# Altium project KOSVT-1.PrjPcb
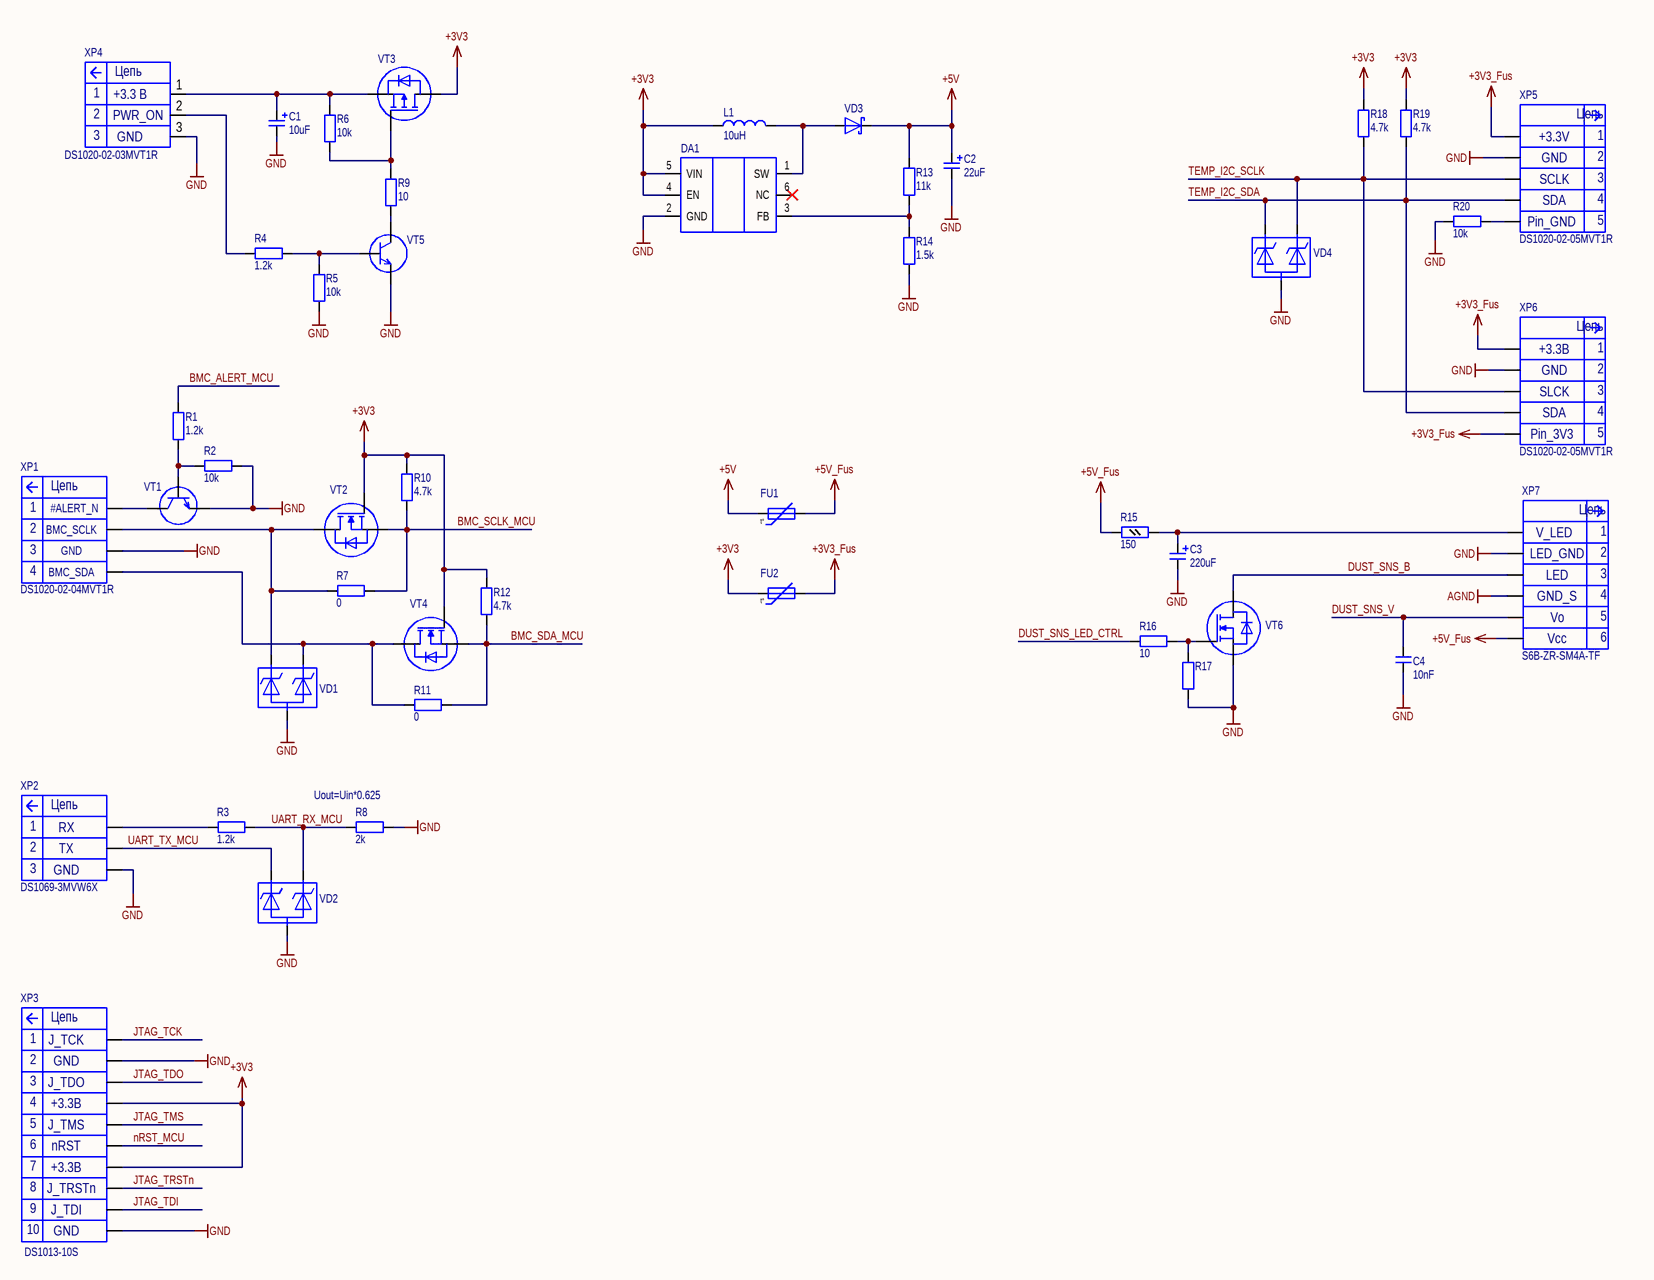
[diagram p0: MAIN.SchDoc]
Формат_PCB: А3; Обозначение_Код: XXXX.468332.001Э3; Обозначение_PCB: XXXX.468332.001Э3; Обозначение: XXXX.468332.001; Наименование_PCB: КОСВТ-01; Наименование1: КОСВТ-01; Наименование: КОСВТ-01; Код_документа_SCH: Э3; Вид_документа_SCH: Схема электрическая принципиальная; Вид_документа: Э3; ProjectName: KOSVT-01; Patch_version: 0; Minor_version: 1; Major_version: 2
2 sheets, 90 parts. Net scope: global (net labels, ports and power ports of the same name join across sheets).
Board file: KOSVT-1.PcbDoc
Sheets:
  MAIN.SchDoc
  MCU.SchDoc

## Sheet MAIN.SchDoc
size 420 x 297 mm; Address1: Address1; Address2: Address2; Address3: Address3; Address4: Address4; SheetNumber: 1; SheetTotal: 2; Разраб.: Шкляев; Обозначение документа: ВРГД.468332.001 Э3; Пров.: Абрамов; Н.контр.: Ермакова; Утв.: Солдатченков; Наименование организации: АО "Вектор развития"; Перв. применение: ВРГД.468332.001; Наименование изделия 1: Плата; Наименование изделия 2: Схема электрическая; Наименование изделия 3: принципиальная; Нач. отд.: Нач. отд.; Фамилия нач. отд.: Кононенко; Наименование изделия 4: КОСВТ-1

### Parts
C1  10uF  [CAP ALSMD ELEC 4.3MM H5.4MM]
C2  22uF  [CAP ALSMD ELEC 4.3MM H5.4MM]
C3  220uF  [CAP ALSMD ELEC 6.6MM H7.7MM]
C4  10nF  [CAP 0603_1608]
DA1  MT3608 AEROSEMI  [TI SOT-23-6 DBV]  (value not drawn)
FU1  BSMD0603-010-15V BHFUSE  [FUSE 0603_1608 0.8MM]  (value not drawn)
FU2  BSMD0603-010-15V BHFUSE  [FUSE 0603_1608 0.8MM]  (value not drawn)
L1  10uH  [MURATA LQH32CN]
R1  1.2k  [RES 0603_1608]
R2  10k  [RES 0603_1608]
R3  1.2k  [RES 0603_1608]
R4  1.2k  [RES 0603_1608]
R5  10k  [RES 0603_1608]
R6  10k  [RES 0603_1608]
R7  0  [RES 0603_1608]
R8  2k  [RES 0603_1608]
R9  10  [RES 0603_1608]
R10  4.7k  [RES 0603_1608]
R11  0  [RES 0603_1608]
R12  4.7k  [RES 0603_1608]
R13  11k  [RES 0603_1608]
R14  1.5k  [RES 0603_1608]
R15  150  [RES 0805_2012]
R16  10  [RES 0603_1608]
R17  (no value)  [RES 0603_1608]
R18  4.7k  [RES 0603_1608]
R19  4.7k  [RES 0603_1608]
R20  10k  [RES 0603_1608]
VD1  PESD5V0U1UT  [SOT-23-3 N]  (value not drawn)
VD2  PESD5V0U1UT  [SOT-23-3 N]  (value not drawn)
VD3  1N5817WS Hottech  [MCC SOD-323]  (value not drawn)
VD4  PESD5V0U1UT  [SOT-23-3 N]  (value not drawn)
VT1  КТ229Б9  [SOT-23-3 N]  (value not drawn)
VT2  КП526А9  [SOT-23-3 N]  (value not drawn)
VT3  AO3401 Hottech  [SOT-23-3 N]  (value not drawn)
VT4  КП526А9  [SOT-23-3 N]  (value not drawn)
VT5  КТ229Б9  [SOT-23-3 N]  (value not drawn)
VT6  КП526А9  [SOT-23-3 N]  (value not drawn)
XP1  DS1020-02-04MVT1R  Net_4: BMC_SDA  Net_3: GND  Net_2: BMC_SCLK  Net_1: #ALERT_N  [DS1020-02-04MVT1R]
XP2  DS1069-3MVW6X  Net_3: GND  Net_1: RX  Net_2: TX  [CONNFLY_DS1069-3M]
XP3  DS1013-10S  Net_10: GND  Net_9: J_TDI  Net_8: J_TRSTn  Net_7: +3.3В  Net_6: nRST  Net_5: J_TMS  Net_3: J_TDO  Net_1: J_TCK  [DS1013-10S]
XP4  DS1020-02-03MVT1R  Net_3: GND  Net_1: +3.3 В  Net_2: PWR_ON  [DS1020-02-03MVT1R]
XP5  DS1020-02-05MVT1R  Net_5: Pin_GND  Net_4: SDA  Net_3: SCLK  Net_2: GND  Net_1: +3.3V  [DS1020-02-05MVT1R]
XP6  DS1020-02-05MVT1R  Net_5: Pin_3V3  Net_4: SDA  Net_3: SLCK  Net_2: GND  Net_1: +3.3В  [DS1020-02-05MVT1R]
XP7  S6B-ZR-SM4A-TF  Net_6: Vcc  Net_5: Vo  Net_4: GND_S  Net_3: LED  Net_2: LED_GND  Net_1: V_LED  [JST S6B-ZR-SM4A-TF]

### Nets
+3V3: DA1.4(EN) DA1.5(VIN) FU2.1 L1.1(P) R10.2 R12.2 R18.2 R19.2 VT2.1(G) VT3.3(D) VT4.1(G) XP3.4 XP3.7
+3V3_Fus: FU2.2 XP5.1 XP6.1 XP6.5
+5V: C2.1(P) FU1.1 R13.2 VD3.2(C)
+5V_Fus: FU1.2 R15.1 XP7.6
AGND: XP7.4
GND: C1.2(N) C2.2(N) C3.2(N) C4.1 DA1.2(GND) R2.1 R5.1 R8.2 R14.1 R17.1 R20.2 VD1.3(A) VD2.3(A) VD4.3(A) VT1.2(E) VT5.2(E) VT6.2(S) XP1.3 XP2.3 XP3.2 XP3.10 XP4.3 XP5.2 XP6.2 XP7.2
BMC_ALERT_MCU: R1.2
BMC_SCLK_MCU: R7.1 R10.1 VT2.2(S)
BMC_SDA_MCU: R11.1 R12.1 VT4.2(S)
DUST_SNS_B: VT6.3(D) XP7.3
DUST_SNS_LED_CTRL: R16.1
DUST_SNS_V: C4.2 XP7.5
JTAG_TCK: XP3.1
JTAG_TDI: XP3.9
JTAG_TDO: XP3.3
JTAG_TMS: XP3.5
JTAG_TRSTn: XP3.8
nRST_MCU: XP3.6
TEMP_I2C_SCLK: R18.1 VD4.2(C2) XP5.3 XP6.3
TEMP_I2C_SDA: R19.1 VD4.1(C1) XP5.4 XP6.4
UART_RX_MCU: R3.2 R8.1 VD2.2(C2)
UART_TX_MCU: VD2.1(C1) XP2.2
NetC1_1: C1.1(P) R6.2 VT3.2(S) XP4.1
NetC3_1: C3.1(P) R15.2 XP7.1
NetDA1_1: DA1.1(SW) L1.2(N) VD3.1(A)
NetDA1_3: DA1.3(FB) R13.1 R14.2
NetR1_1: R1.1 R2.2 VT1.1(B)
NetR3_1: R3.1 XP2.1
NetR4_1: R4.1 XP4.2
NetR4_2: R4.2 R5.2 VT5.1(B)
NetR6_1: R6.1 R9.1 VT3.1(G)
NetR7_2: R7.2 VD1.1(C1) VT2.3(D) XP1.2
NetR9_2: R9.2 VT5.3(C)
NetR11_2: R11.2 VD1.2(C2) VT4.3(D) XP1.4
NetR16_2: R16.2 R17.2 VT6.1(G)
NetR20_1: R20.1 XP5.5
NetVT1_3: VT1.3(C) XP1.1

Not connected (* = marked no-connect by the designer): DA1 6(NC)*

### Notes on the sheet
- (near R8) Uout=Uin*0.625
- Перв. примен.
- Справ. №
- Подп. и дата
- Инв. № дубл.
- Взам. инв. №
- Разраб.
- Изм.
- Лист
- № докум.
- Подп.
- Дата
- Лит.
- Масса
- Масштаб
- Пров.
- Листов
- Инв. № подл.
- Утв.
- Н.контр.
- Копировал
- Формат А3
- (in symbol BSMD0603-010-15V BHFUSE) t°
- (in symbol DS1013-10S) Цепь
- (in symbol DS1020-02-03MVT1R) Цепь
- (in symbol DS1020-02-04MVT1R) Цепь
- (in symbol DS1020-02-05MVT1R) Цепь
- (in symbol DS1069-3MVW6X) Цепь
- (in symbol S6B-ZR-SM4A-TF) Цепь

### Library data of the parts
C1 = К50-97 – 25В – 10мкФ (±20) % – ЕВАЯ.673541.054ТУ: Конденсатор К50-97 – 25В – 10мкФ (±20) % – ЕВАЯ.673541.054ТУ; Manufacturer: АО Элеконд; Group: Конденсаторы полярные; Type: Конденсатор электролитический; Tolerance: ± 20%; Dielectric type: Electrolytic; Voltage: 25V; Manufacturer Part Number: К50-97 – 25В – 10мкФ (±20) % – ЕВАЯ.673541.054ТУ; Name: К50-97 – 25В – 10мкФ (±20) % – ЕВАЯ.673541.054ТУ; Value: 10uF; Country: Россия; Package: SMD D4x5.4; HelpURL: https://elecond.ru/pdf/k50-97.pdf
C2 = К50-97 – 16В – 22мкФ (±20) % – ЕВАЯ.673541.054ТУ: Конденсатор К50-97 – 16В – 22мкФ (±20) % – ЕВАЯ.673541.054ТУ; Manufacturer: АО Элеконд; Group: Конденсаторы полярные; Type: Конденсатор электролитический; Tolerance: ± 20%; Dielectric type: Electrolytic; Voltage: 16V; Manufacturer Part Number: К50-97 – 16В – 22мкФ (±20) % – ЕВАЯ.673541.054ТУ; Name: К50-97 – 16В – 22мкФ (±20) % – ЕВАЯ.673541.054ТУ; Value: 22uF; Country: Россия; Package: SMD D4x5.4; HelpURL: https://elecond.ru/pdf/k50-97.pdf
C3 = К50-97 – 16В – 220мкФ (±20) % – ЕВАЯ.673541.054ТУ: Конденсатор К50-97 – 16В – 220мкФ (±20) % – ЕВАЯ.673541.054ТУ; Manufacturer: АО Элеконд; Group: Конденсаторы полярные; Type: Конденсатор электролитический; Tolerance: ± 20%; Dielectric type: Electrolytic; Voltage: 16V; Manufacturer Part Number: К50-97 – 16В – 220мкФ (±20) % – ЕВАЯ.673541.054ТУ; Name: К50-97 – 16В – 220мкФ (±20) % – ЕВАЯ.673541.054ТУ; Value: 220uF; Country: Россия; Package: SMD D6.3x7.7; HelpURL: https://elecond.ru/pdf/k50-97.pdf
C4 = GRM188R71E103K: Конденсатор 0603-X7R-25В-10мкФ ± 10%; Manufacturer: Murata Electronics; Group: Конденсаторы; Type: Конденсатор керамический; Dielectric type: X7R; Voltage: 25V; Manufacturer Part Number: GRM188R71E103K; Name: GRM188R71E103K; Value: 10nF; Tolerance: ± 10%; Country: Япония; Package: SMD0603
DA1 = MT3608 AEROSEMI: Микросхема MT3608; Group: Микросхемы; Input Voltage: 2V to 24V; Output Voltage: Up to 28V; Max Temperature: 150°С; Min Temperature: -40°С; Manufacturer Part Number: MT3608 AEROSEMI; Type: Импульсный повышающий преобразователь; Name: MT3608; Country: Китай; Manufacturer: AEROSEMI; Package: SOT23-6
FU1 FU2 = BSMD0603-010-15V BHFUSE: Предохранитель самовосстанавливающийся BSMD0603-010-15V; Group: Предохранители; I hold: 0.1A; I trip: 0.3A; V: 15V; Manufacturer Part Number: BSMD0603-010-15V BHFUSE; Type: Предохранитель самовосстанавливающийся; Name: BSMD0603-010-15V; Country: Китай; Manufacturer: BHFUSE; Package: SMD0603; HelpURL: https://static.chipdip.ru/lib/966/DOC042966016.pdf
L1 = LQH32CN100K33L: Индуктивность 1210-0,45A-10мкГ ± 10%; Manufacturer: Murata Electronics; Group: Индуктивности; Current: 450mA; Rdc: 0.3Ohm; SRfreq: 26MHz; Manufacturer Part Number: LQH32CN100K33L; Type: Индуктивности; Name: LQH32CN100K33L; Value: 10uH; Tolerance: ± 10%; Country: Япония; Package: SMD1206
R1 R3 R4 = Р1-12 - 0,1 - 1,2кОм ±1%: Резистор Р1-12 - 0,1 - 1,2кОм ±1%; Manufacturer: АО «Ресурс»; Group: Резисторы; Power: 0.1W; Voltage: 50V; Manufacturer Part Number: Р1-12 - 0,1 - 1,2кОм ±1%; Type: Резистор; Name: Р1-12 - 0,1 - 1,2кОм ±1%; Value: 1.2k; Tolerance: ± 1%; Country: Россия; Package: SMD0603; HelpURL: https://aoresurs.com/upload/iblock/4b6/hnw668dxbiwjyxv0ejq9urcu5m58703r/Datasheet-R1_12-SHKAB.434110.024TU.pdf
R2 R5 R6 R20 = Р1-12 - 0,1 - 10кОм ±1%: Резистор Р1-12 - 0,1 - 10кОм ±1%; Manufacturer: АО «Ресурс»; Group: Резисторы; Power: 0.1W; Voltage: 50V; Manufacturer Part Number: Р1-12 - 0,1 - 10кОм ±1%; Type: Резистор; Name: Р1-12 - 0,1 - 10кОм ±1%; Value: 10k; Tolerance: ± 1%; Country: Россия; Package: SMD0603; HelpURL: https://aoresurs.com/upload/iblock/4b6/hnw668dxbiwjyxv0ejq9urcu5m58703r/Datasheet-R1_12-SHKAB.434110.024TU.pdf
R7 R11 = Р1-12 - 0603 - 0,05: Перемычка Р1-12 - 0603 - 0,05; Manufacturer: АО «Ресурс»; Group: Резисторы; Power: 3A; Manufacturer Part Number: Р1-12 - 0603 - 0,05; Type: Перемычка; Name: Р1-12 - 0603 - 0,05; Value: 0; Country: Россия; Package: SMD0603; HelpURL: https://aoresurs.com/upload/iblock/b10/xo9xl0w0128k43psd6nz5q3kfcc2cprs/peremychka-R1_12-SHKAB.434110.025TU.pdf
R8 = Р1-12 - 0,1 - 2кОм ±1%: Резистор Р1-12 - 0,1 - 2кОм ±1%; Manufacturer: АО «Ресурс»; Group: Резисторы; Power: 0.1W; Voltage: 50V; Manufacturer Part Number: Р1-12 - 0,1 - 2кОм ±1%; Type: Резистор; Name: Р1-12 - 0,1 - 2кОм ±1%; Value: 2k; Tolerance: ± 1%; Country: Россия; Package: SMD0603; HelpURL: https://aoresurs.com/upload/iblock/4b6/hnw668dxbiwjyxv0ejq9urcu5m58703r/Datasheet-R1_12-SHKAB.434110.024TU.pdf
R9 R16 = Р1-12 - 0,1 - 10Ом ±1%: Резистор Р1-12 - 0,1 - 10Ом ±1%; Manufacturer: АО «Ресурс»; Group: Резисторы; Power: 0.1W; Voltage: 50V; Manufacturer Part Number: Р1-12 - 0,1 - 10Ом ±1%; Type: Резистор; Name: Р1-12 - 0,1 - 10Ом ±1%; Value: 10; Tolerance: ± 1%; Country: Россия; Package: SMD0603; HelpURL: https://aoresurs.com/upload/iblock/4b6/hnw668dxbiwjyxv0ejq9urcu5m58703r/Datasheet-R1_12-SHKAB.434110.024TU.pdf
R10 R12 R18 R19 = Р1-12 - 0,1 - 4,7кОм ±1%: Резистор Р1-12 - 0,1 - 4,7кОм ±1%; Manufacturer: АО «Ресурс»; Group: Резисторы; Power: 0.1W; Voltage: 50V; Manufacturer Part Number: Р1-12 - 0,1 - 4,7кОм ±1%; Type: Резистор; Name: Р1-12 - 0,1 - 4,7кОм ±1%; Value: 4.7k; Tolerance: ± 1%; Country: Россия; Package: SMD0603; HelpURL: https://aoresurs.com/upload/iblock/4b6/hnw668dxbiwjyxv0ejq9urcu5m58703r/Datasheet-R1_12-SHKAB.434110.024TU.pdf
R13 = Р1-12 - 0,1 - 11кОм ±1%: Резистор Р1-12 - 0,1 - 11кОм ±1%; Manufacturer: АО «Ресурс»; Group: Резисторы; Power: 0.1W; Voltage: 50V; Manufacturer Part Number: Р1-12 - 0,1 - 11кОм ±1%; Type: Резистор; Name: Р1-12 - 0,1 - 11кОм ±1%; Value: 11k; Tolerance: ± 1%; Country: Россия; Package: SMD0603; HelpURL: https://aoresurs.com/upload/iblock/4b6/hnw668dxbiwjyxv0ejq9urcu5m58703r/Datasheet-R1_12-SHKAB.434110.024TU.pdf
R14 = Р1-12 - 0,1 - 1,5кОм ±1%: Резистор Р1-12 - 0,1 - 1,5кОм ±1%; Manufacturer: АО «Ресурс»; Group: Резисторы; Power: 0.1W; Voltage: 50V; Manufacturer Part Number: Р1-12 - 0,1 - 1,5кОм ±1%; Type: Резистор; Name: Р1-12 - 0,1 - 1,5кОм ±1%; Value: 1.5k; Tolerance: ± 1%; Country: Россия; Package: SMD0603; HelpURL: https://aoresurs.com/upload/iblock/4b6/hnw668dxbiwjyxv0ejq9urcu5m58703r/Datasheet-R1_12-SHKAB.434110.024TU.pdf
R15 = Р1-12 - 0,125 - 150Ом ±1%: Резистор Р1-12 - 0,125 - 150Ом ±1%; Manufacturer: АО «Ресурс»; Group: Резисторы; Power: 0.125W; Voltage: 150V; Manufacturer Part Number: Р1-12 - 0,125 - 150Ом ±1%; Type: Резистор; Name: Р1-12 - 0,125 - 150Ом ±1%; Value: 150; Tolerance: ± 1%; Country: Россия; Package: SMD0805; HelpURL: https://aoresurs.com/upload/iblock/4b6/hnw668dxbiwjyxv0ejq9urcu5m58703r/Datasheet-R1_12-SHKAB.434110.024TU.pdf
R17 = Р1-12 - 0,1 - 10кОм ±1%: Резистор Р1-12 - 0,1 - 10кОм ±1%; Manufacturer: АО «Ресурс»; Group: Резисторы; Value: 10k; Power: 0.1W; Voltage: 50V; Manufacturer Part Number: Р1-12 - 0,1 - 10кОм ±1%; Type: Резистор; Name: Р1-12 - 0,1 - 10кОм ±1%; Tolerance: ± 1%; Country: Россия; Package: SMD0603; HelpURL: https://aoresurs.com/upload/iblock/4b6/hnw668dxbiwjyxv0ejq9urcu5m58703r/Datasheet-R1_12-SHKAB.434110.024TU.pdf
VD1 VD2 VD4 = PESD5V0U1UT: Диод ESD PESD5V0U1UT; Manufacturer: UTD Semiconductor; Group: Диоды; Type: Сборка ESD диодов; Vrwm: 5V; Manufacturer Part Number: PESD5V0U1UT; Package: SOT23-132; Name: PESD5V0U1UT; Country: Китай
VD3 = 1N5817WS Hottech: Диод Шоттки 1N5817WS; Group: Диоды; Max Vr: 20V; Max If: 1A; Manufacturer Part Number: 1N5817WS Hottech; Type: Диод Шоттки; Name: 1N5817WS; Country: Китай; Manufacturer: Hottech; Package: SOD-323
VT1 VT5 = КТ229Б9 АДКБ.432140.555 ТУ: Транзистор КТ229Б9 АДКБ.432140.555 ТУ; Manufacturer: Кремний Эл; Group: Транзисторы; Type: Транзистор биполярный; Struct: NPN; Vds/Vce: 45V; Id/Ic: 500mA; h21: 100-250; Manufacturer Part Number: КТ229Б9 АДКБ.432140.555 ТУ; Name: КТ229Б9; Country: Россия; Package: SOT-23-132; HelpURL: https://group-kremny.ru/upload/iblock/c8e/c8e3c704764e7e34f4ed87f6430e15b8.pdf
VT2 VT4 VT6 = КП526А9 АДКБ.432140.549 ТУ: Транзистор КП546А9 АДКБ.432140.549; Manufacturer: Кремний Эл; Group: Транзисторы; Type: Транзистор полевой; Struct: N-MOSFET; Vds/Vce: 30V; Id/Ic: 2; Vth: 1.45; Manufacturer Part Number: КП526А9 АДКБ.432140.549 ТУ; Name: КП526А9; Country: Россия; Package: SOT-23-132
VT3 = AO3401 Hottech: Транзистор  AO3401 Hottech; Group: Транзисторы; Type: Транзистор полевой; Struct: P-MOSFET; Vds/Vce: -30V; Id/Ic: -4A; Vth: -1.3V; Manufacturer Part Number: AO3401 Hottech; Name: AO3401; Country: Китай; Manufacturer: Hottech; Package: SOT-23-132; HelpURL: https://cdn.promelec.ru/upload/items/2023/12/08/AO3401%20SOT-23.pdf
XP1 = DS1020-02-04MVT1R: Соединитель DS1020-02-04MVT1R; Manufacturer: Connfly; Group: Соединители; Pins number: 4; Rows: 1; Nominal Voltage: 250V; Max Temperature: 105°С; Min Temperature: -40°С; Manufacturer Part Number: DS1020-02-04MVT1R; Type: Вилка угловая; Name: DS1020-02-04MVT1R; Country: Китай
XP2 = DS1069-3MVW6X: Соединитель DS1069-3MVW6X; Manufacturer: Connfly; Group: Соединители; Pins number: 3; Rows: 1; Nominal current: 3A; Nominal Voltage: 250V; Max Temperature: 85°С; Min Temperature: -25°С; Manufacturer Part Number: DS1069-3MVW6X; Type: Вилка прямая; Name: DS1069-3MVW6X; Country: Китай
XP3 = DS1013-10S: Соединитель DS1013-10S; Manufacturer: Connfly; Group: Соединители; Pins number: 10; Rows: 2; Nominal current: 1A; Nominal Voltage: 500V; Max Temperature: 105°С; Min Temperature: -40°С; Manufacturer Part Number: DS1013-10S; Type: Вилка прямая; Net_4: +3.3В; Net_2: GND; Name: DS1013-10S; Country: Китай
XP4 = DS1020-02-03MVT1R: Соединитель DS1020-02-03MVT1R; Manufacturer: Connfly; Group: Соединители; Pins number: 3; Rows: 1; Nominal Voltage: 250V; Max Temperature: 105°С; Min Temperature: -40°С; Manufacturer Part Number: DS1020-02-03MVT1R; Type: Вилка угловая; Name: DS1020-02-03MVT1R; Country: Китай
XP5 XP6 = DS1020-02-05MVT1R: Соединитель DS1020-02-05MVT1R; Manufacturer: Connfly; Group: Соединители; Pins number: 5; Rows: 1; Nominal Voltage: 250V; Max Temperature: 105°С; Min Temperature: -40°С; Manufacturer Part Number: DS1020-02-05MVT1R; Type: Вилка угловая; Name: DS1020-02-05MVT1R; Country: Китай
XP7 = S6B-ZR-SM4A-TF: Соединитель S6B-ZR-SM4A-TF; Manufacturer: JST; Group: Соединители; Pins number: 6; Rows: 1; Nominal current: 1A; Nominal Voltage: 50V; Max Temperature: 85°С; Min Temperature: -25°С; Manufacturer Part Number: S6B-ZR-SM4A-TF; Type: Вилка угловая; Name: S6B-ZR-SM4A-TF; Country: Япония

## Sheet MCU.SchDoc
size 420 x 297 mm; Address1: Address1; Address2: Address2; Address3: Address3; Address4: Address4; SheetNumber: 2; SheetTotal: 2; Scale: 1:1; Обозначение документа: ВРГД.468332.001 Э3
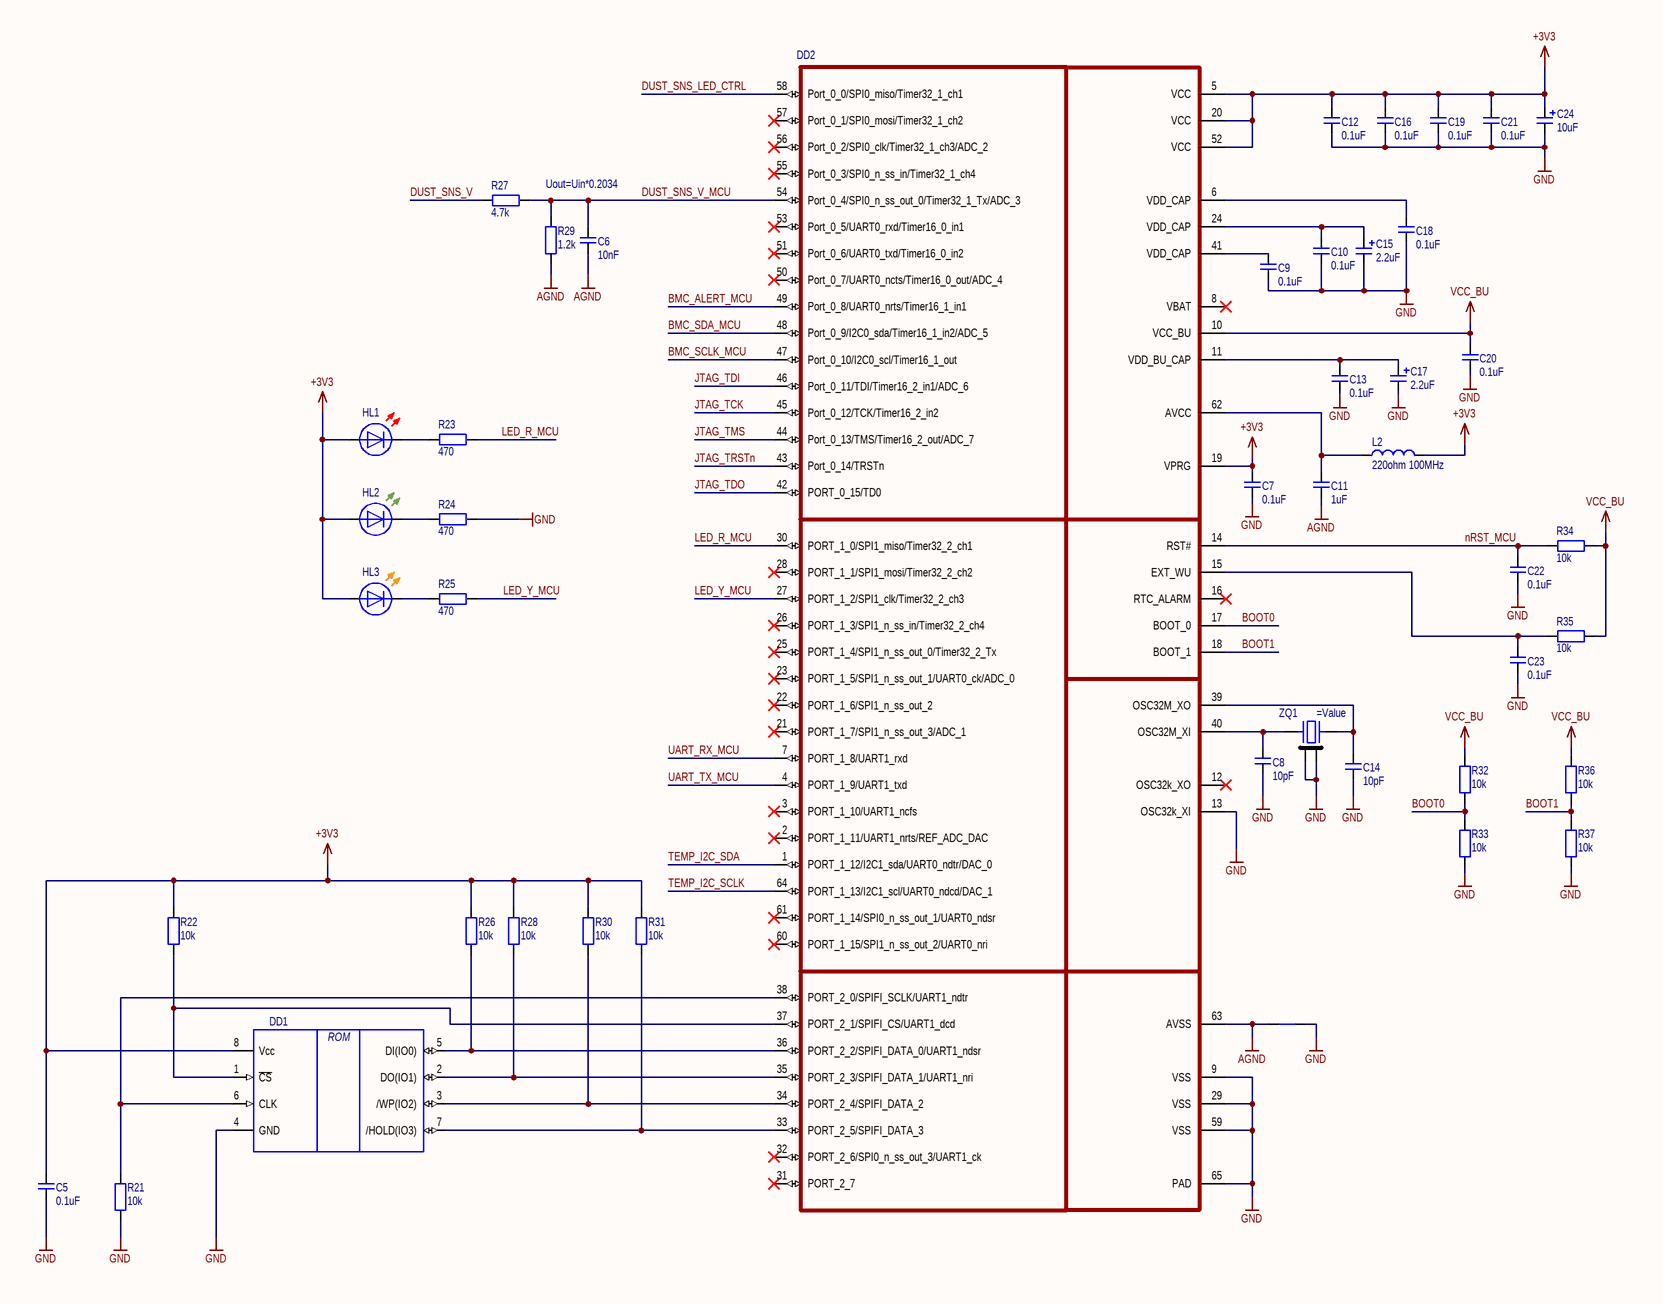
[diagram p1: MCU.SchDoc]

### Parts
C5  0.1uF  [CAP 0603_1608]
C6  10nF  [CAP 0603_1608]
C7  0.1uF  [CAP 0603_1608]
C8  10pF  [CAP 0603_1608]
C9  0.1uF  [CAP 0603_1608]
C10  0.1uF  [CAP 0603_1608]
C11  1uF  [CAP 0805_2012]
C12  0.1uF  [CAP 0603_1608]
C13  0.1uF  [CAP 0603_1608]
C14  10pF  [CAP 0603_1608]
C15  2.2uF  [CAP ALSMD ELEC 4.3MM H5.4MM]
C16  0.1uF  [CAP 0603_1608]
C17  2.2uF  [CAP ALSMD ELEC 4.3MM H5.4MM]
C18  0.1uF  [CAP 0603_1608]
C19  0.1uF  [CAP 0603_1608]
C20  0.1uF  [CAP 0603_1608]
C21  0.1uF  [CAP 0603_1608]
C22  0.1uF  [CAP 0603_1608]
C23  0.1uF  [CAP 0603_1608]
C24  10uF  [CAP ALSMD ELEC 4.3MM H5.4MM]
DD1  W25Q16JVSNIQ  [WINBOND SOIC-8]  (value not drawn)
DD2  К1948ВК018 АДКБ.431290.418ТУ  [QFN40P800X800X76_HS-65M]  (value not drawn)
HL1  KP-1608SURC  [LED 0603_1608 RED]  (value not drawn)
HL2  KPH-1608MGC  [LED 0603_1608 GREEN]  (value not drawn)
HL3  KPH-1608SYC  [LED 0603_1608 YELLOW]  (value not drawn)
J1  (no value)  [NET_TIE_1MM]  (net tie, no BOM)
L2  220ohm 100MHz  [FER 0805_2012]
R21  10k  [RES 0603_1608]
R22  10k  [RES 0603_1608]
R23  470  [RES 0603_1608]
R24  470  [RES 0603_1608]
R25  470  [RES 0603_1608]
R26  10k  [RES 0603_1608]
R27  4.7k  [RES 0603_1608]
R28  10k  [RES 0603_1608]
R29  1.2k  [RES 0603_1608]
R30  10k  [RES 0603_1608]
R31  10k  [RES 0603_1608]
R32  10k  [RES 0603_1608]
R33  10k  [RES 0603_1608]
R34  10k  [RES 0603_1608]
R35  10k  [RES 0603_1608]
R36  10k  [RES 0603_1608]
R37  10k  [RES 0603_1608]
ZQ1  (no value)  [XTAL3225X07N]

### Nets
+3V3: C5.2 C7.2 C12.2 C16.2 C19.2 C21.2 C24.1(P) DD1.8(Vcc) DD2.5(VCC) DD2.19(VPRG) DD2.20(VCC) DD2.52(VCC) HL1.1(A) HL2.1(A) HL3.1(A) L2.2(N) R22.1 R26.2 R28.2 R30.2 R31.2
AGND: C6.1 C11.1 DD2.63(AVSS) J1.1(P) R29.1
GND: C5.1 C7.1 C8.1 C9.1 C10.1 C12.1 C13.1 C14.1 C15.2(N) C16.1 C17.2(N) C18.1 C19.1 C20.1 C21.1 C22.1 C23.1 C24.2(N) DD1.4(GND) DD2.9(VSS) DD2.13(OSC32k_XI) DD2.29(VSS) DD2.59(VSS) DD2.65(PAD) J1.2(N) R21.1 R24.2 R33.1 R37.1 ZQ1.2 ZQ1.4
VCC_BU: C20.2 DD2.10(VCC_BU) R32.2 R34.1 R35.1 R36.2
BMC_ALERT_MCU: DD2.49(Port_0_8/UART0_nrts/Timer16_1_in1)
BMC_SCLK_MCU: DD2.47(Port_0_10/I2C0_scl/Timer16_1_out)
BMC_SDA_MCU: DD2.48(Port_0_9/I2C0_sda/Timer16_1_in2/ADC_5)
BOOT0: DD2.17(BOOT_0) R32.1 R33.2
BOOT1: DD2.18(BOOT_1) R36.1 R37.2
DUST_SNS_LED_CTRL: DD2.58(Port_0_0/SPI0_miso/Timer32_1_ch1)
DUST_SNS_V: R27.1
DUST_SNS_V_MCU: C6.2 DD2.54(Port_0_4/SPI0_n_ss_out_0/Timer32_1_Tx/ADC_3) R27.2 R29.2
JTAG_TCK: DD2.45(Port_0_12/TCK/Timer16_2_in2)
JTAG_TDI: DD2.46(Port_0_11/TDI/Timer16_2_in1/ADC_6)
JTAG_TDO: DD2.42(PORT_0_15/TD0)
JTAG_TMS: DD2.44(Port_0_13/TMS/Timer16_2_out/ADC_7)
JTAG_TRSTn: DD2.43(Port_0_14/TRSTn)
LED_R_MCU: DD2.30(PORT_1_0/SPI1_miso/Timer32_2_ch1) R23.2
LED_Y_MCU: DD2.27(PORT_1_2/SPI1_clk/Timer32_2_ch3) R25.2
nRST_MCU: C22.2 DD2.14(RST#) R34.2
TEMP_I2C_SCLK: DD2.64(PORT_1_13/I2C1_scl/UART0_ndcd/DAC_1)
TEMP_I2C_SDA: DD2.1(PORT_1_12/I2C1_sda/UART0_ndtr/DAC_0)
UART_RX_MCU: DD2.7(PORT_1_8/UART1_rxd)
UART_TX_MCU: DD2.4(PORT_1_9/UART1_txd)
NetC8_2: C8.2 DD2.40(OSC32M_XI) ZQ1.1
NetC9_2: C9.2 DD2.41(VDD_CAP)
NetC10_2: C10.2 C15.1(P) DD2.24(VDD_CAP)
NetC11_2: C11.2 DD2.62(AVCC) L2.1(P)
NetC13_2: C13.2 C17.1(P) DD2.11(VDD_BU_CAP)
NetC14_2: C14.2 DD2.39(OSC32M_XO) ZQ1.3
NetC18_2: C18.2 DD2.6(VDD_CAP)
NetC23_2: C23.2 DD2.15(EXT_WU) R35.2
NetDD1_1: DD1.1(~{CS}) DD2.37(PORT_2_1/SPIFI_CS/UART1_dcd) R22.2
NetDD1_2: DD1.2(DO(IO1)) DD2.35(PORT_2_3/SPIFI_DATA_1/UART1_nri) R28.1
NetDD1_3: DD1.3(/WP(IO2)) DD2.34(PORT_2_4/SPIFI_DATA_2) R30.1
NetDD1_5: DD1.5(DI(IO0)) DD2.36(PORT_2_2/SPIFI_DATA_0/UART1_ndsr) R26.1
NetDD1_6: DD1.6(CLK) DD2.38(PORT_2_0/SPIFI_SCLK/UART1_ndtr) R21.2
NetDD1_7: DD1.7(/HOLD(IO3)) DD2.33(PORT_2_5/SPIFI_DATA_3) R31.1
NetHL1_2: HL1.2(C) R23.1
NetHL2_2: HL2.2(C) R24.1
NetHL3_2: HL3.2(C) R25.1

Not connected (* = marked no-connect by the designer): DD2 2(PORT_1_11/UART1_nrts/REF_ADC_DAC)* 3(PORT_1_10/UART1_ncfs)* 8(VBAT)* 12(OSC32k_XO)* 16(RTC_ALARM)* 21(PORT_1_7/SPI1_n_ss_out_3/ADC_1)* 22(PORT_1_6/SPI1_n_ss_out_2)* 23(PORT_1_5/SPI1_n_ss_out_1/UART0_ck/ADC_0)* 25(PORT_1_4/SPI1_n_ss_out_0/Timer32_2_Tx)* 26(PORT_1_3/SPI1_n_ss_in/Timer32_2_ch4)* 28(PORT_1_1/SPI1_mosi/Timer32_2_ch2)* 31(PORT_2_7)* 32(PORT_2_6/SPI0_n_ss_out_3/UART1_ck)* 50(Port_0_7/UART0_ncts/Timer16_0_out/ADC_4)* 51(Port_0_6/UART0_txd/Timer16_0_in2)* 53(Port_0_5/UART0_rxd/Timer16_0_in1)* 55(Port_0_3/SPI0_n_ss_in/Timer32_1_ch4)* 56(Port_0_2/SPI0_clk/Timer32_1_ch3/ADC_2)* 57(Port_0_1/SPI0_mosi/Timer32_1_ch2)* 60(PORT_1_15/SPI1_n_ss_out_2/UART0_nri)* 61(PORT_1_14/SPI0_n_ss_out_1/UART0_ndsr)*

### Notes on the sheet
- Uout=Uin*0.2034
- Подп. и дата
- Инв. № дубл.
- Взам. инв. №
- Инв. № подл.
- Изм.
- Лист
- № докум.
- Подп.
- Дата
- Копировал
- Формат А3
- (in symbol W25Q16JVSNIQ) ROM

### Library data of the parts
C5 C7 C9 C10 C12 C13 C16 C18-C23 = GRM188R71E104K: Конденсатор 0603-X7R-25В-0,1мкФ ± 10%; Manufacturer: Murata Electronics; Group: Конденсаторы; Type: Конденсатор керамический; Dielectric type: X7R; Voltage: 25V; Manufacturer Part Number: GRM188R71E104K; Name: GRM188R71E104K; Value: 0.1uF; Tolerance: ± 10%; Country: Япония; Package: SMD0603
C6 = GRM188R71E103K: as C4 on sheet MAIN; Manufacturer Part Number: GRM188R71E103K; Name: GRM188R71E103K; Value: 10nF; Tolerance: ± 10%; Country: Япония; Package: SMD0603
C8 C14 = CC0603KRNPO9BN100: Конденсатор 0603-C0G-50В-10пФ ± 10%; Manufacturer: Yageo; Group: Конденсаторы; Type: Конденсатор керамический; Dielectric type: C0G; Voltage: 50V; Manufacturer Part Number: CC0603KRNPO9BN100; Name: CC0603KRNPO9BN100; Value: 10pF; Tolerance: ± 10%; Country: Тайвань; Package: SMD0603
C11 = GRM21BR71E105KA99L: Конденсатор 0805-X7R-25В-1мкФ ± 10%; Manufacturer: Murata Electronics; Group: Конденсаторы; Type: Конденсатор керамический; Dielectric type: X7R; Voltage: 25V; Manufacturer Part Number: GRM21BR71E105KA99L; Name: GRM21BR71E105KA99L; Value: 1uF; Tolerance: ± 10%; Country: Япония; Package: SMD0805
C15 C17 = К50-97 – 50В – 2,2мкФ (±20) % – ЕВАЯ.673541.054ТУ: Конденсатор К50-97 – 50В – 2,2мкФ (±20) % – ЕВАЯ.673541.054ТУ; Manufacturer: АО Элеконд; Group: Конденсаторы полярные; Type: Конденсатор электролитический; Tolerance: ± 20%; Dielectric type: Electrolytic; Voltage: 50V; Manufacturer Part Number: К50-97 – 50В – 2,2мкФ (±20) % – ЕВАЯ.673541.054ТУ; Name: К50-97 – 50В – 2,2мкФ (±20) % – ЕВАЯ.673541.054ТУ; Value: 2.2uF; Country: Россия; Package: SMD D4x5.4; HelpURL: https://elecond.ru/pdf/k50-97.pdf
C24 = К50-97 – 25В – 10мкФ (±20) % – ЕВАЯ.673541.054ТУ: as C1 on sheet MAIN; Manufacturer Part Number: К50-97 – 25В – 10мкФ (±20) % – ЕВАЯ.673541.054ТУ; Name: К50-97 – 25В – 10мкФ (±20) % – ЕВАЯ.673541.054ТУ; Value: 10uF; Country: Россия; Package: SMD D4x5.4; HelpURL: https://elecond.ru/pdf/k50-97.pdf
DD1 = W25Q16JVSNIQ: Память Flash W25Q16JVSNIQ; Manufacturer: Winbond; Group: Микросхемы; Supply Voltage: 3,3V; Max Temperature: 85°С; Min Temperature: -40°С; Notes: 16Mb(2M x 8); Manufacturer Part Number: W25Q16JVSNIQ; Type: Память Flash; Name: W25Q16JVSNIQ; Country: Тайвань; Package: SOIC-8; HelpURL: https://static.chipdip.ru/lib/136/DOC012136857.pdf
DD2 = К1948ВК018 АДКБ.431290.418ТУ: Микроконтроллер К1948ВК018 АДКБ.431290.418ТУ; Manufacturer: АО «МИКРОН»; Group: Микросхемы; Supply Voltage: 3,3V; Max Temperature: 85°С; Min Temperature: -45°С; Manufacturer Part Number: К1948ВК018 АДКБ.431290.418ТУ; Type: Микроконтроллер; Package: QFN40; HelpURL: https://mikron.ru/upload/docs/mcu/Information_AMUR_MIK32.pdf; Name: К1948ВК018 АДКБ.431290.418ТУ; Country: Россия
HL1 = KP-1608SURC: Светодиод KP-1608SURC; Manufacturer: Kingbright; Group: Светодиоды; Max Vr: 5V; Max If: 20mA; Manufacturer Part Number: KP-1608SURC; Type: Светодиод; Name: KP-1608SURC; Country: Тайвань; Package: SMD1608
HL2 = KPH-1608MGC: Светодиод KPH-1608MGC; Manufacturer: Kingbright; Group: Светодиоды; Max Vr: 5V; Max If: 20mA; Manufacturer Part Number: KPH-1608MGC; Type: Светодиод; Name: KPH-1608MGC; Country: Тайвань; Package: SMD1608
HL3 = KPH-1608SYC: Светодиод KPH-1608SYC; Manufacturer: Kingbright; Group: Светодиоды; Max Vr: 5V; Max If: 20mA; Manufacturer Part Number: KPH-1608SYC; Type: Светодиод; Name: KPH-1608SYC; Country: Тайвань; Package: SMD1608
J1 = NET_TIE_1MM: Перемычка SMD NET_TIE_1MM; Group: Перемычки; Manufacturer Part Number: NET_TIE_1MM; Type: Перемычка SMD; Name: NET_TIE_1MM
L2 = UPZ2012U221-3R0TF: Индуктивность ЭМП 0805-3A-220Ом ± 25% 100MHz; Manufacturer: Sunlord; Group: Индуктивности; Type: Дроссель ЭМП; Current: 3A; Rdc: 40mОm; Manufacturer Part Number: UPZ2012U221-3R0TF; Name: UPZ2012U221-3R0TF; Value: 220ohm 100MHz; Tolerance: ±25%; Country: Китай; Package: SMD0805; HelpURL: https://static.chipdip.ru/lib/840/DOC012840723.pdf
R21 R22 R26 R28 R30-R37 = Р1-12 - 0,1 - 10кОм ±1%: as R2 on sheet MAIN; Manufacturer Part Number: Р1-12 - 0,1 - 10кОм ±1%; Type: Резистор; Name: Р1-12 - 0,1 - 10кОм ±1%; Value: 10k; Tolerance: ± 1%; Country: Россия; Package: SMD0603; HelpURL: https://aoresurs.com/upload/iblock/4b6/hnw668dxbiwjyxv0ejq9urcu5m58703r/Datasheet-R1_12-SHKAB.434110.024TU.pdf
R23-R25 = Р1-12 - 0,1 - 470Ом ±1%: Резистор Р1-12 - 0,1 - 470Ом ±1%; Manufacturer: АО «Ресурс»; Group: Резисторы; Power: 0.1W; Voltage: 50V; Manufacturer Part Number: Р1-12 - 0,1 - 470Ом ±1%; Type: Резистор; Name: Р1-12 - 0,1 - 470Ом ±1%; Value: 470; Tolerance: ± 1%; Country: Россия; Package: SMD0603; HelpURL: https://aoresurs.com/upload/iblock/4b6/hnw668dxbiwjyxv0ejq9urcu5m58703r/Datasheet-R1_12-SHKAB.434110.024TU.pdf
R27 = Р1-12 - 0,1 - 4,7кОм ±1%: as R10 on sheet MAIN; Manufacturer Part Number: Р1-12 - 0,1 - 4,7кОм ±1%; Type: Резистор; Name: Р1-12 - 0,1 - 4,7кОм ±1%; Value: 4.7k; Tolerance: ± 1%; Country: Россия; Package: SMD0603; HelpURL: https://aoresurs.com/upload/iblock/4b6/hnw668dxbiwjyxv0ejq9urcu5m58703r/Datasheet-R1_12-SHKAB.434110.024TU.pdf
R29 = Р1-12 - 0,1 - 1,2кОм ±1%: as R1 on sheet MAIN; Manufacturer Part Number: Р1-12 - 0,1 - 1,2кОм ±1%; Type: Резистор; Name: Р1-12 - 0,1 - 1,2кОм ±1%; Value: 1.2k; Tolerance: ± 1%; Country: Россия; Package: SMD0603; HelpURL: https://aoresurs.com/upload/iblock/4b6/hnw668dxbiwjyxv0ejq9urcu5m58703r/Datasheet-R1_12-SHKAB.434110.024TU.pdf
ZQ1 = SJK-7U-32.000-10-10-40-C-10: Резонатор кварцевый SJK-7U-32.000-10-10-40-C-10; Manufacturer: SJK; Value: 32MHz; Group: Кварцы; Tolerance: ±30ppm; Load Capacity: 10pF; ESR: 60Ohm; Manufacturer Part Number: SJK-7U-32.000-10-10-40-C-10; Type: Кварцевый резонатор; Name: SJK-7U-32.000-10-10-40-C-10; Freq: 32MHz; Country: Китай; Package: SMD32x25x07; HelpURL: https://static.chipdip.ru/lib/087/DOC053087027.pdf

## Nets that join several sheets
+3V3: MAIN (13 pins), MCU (21 pins)
AGND: MAIN (XP7.4), MCU (5 pins)
GND: MAIN (25 pins), MCU (31 pins)
BMC_ALERT_MCU: MAIN (R1.2), MCU (DD2.49)
BMC_SCLK_MCU: MAIN (R7.1 R10.1 VT2.2), MCU (DD2.47)
BMC_SDA_MCU: MAIN (R11.1 R12.1 VT4.2), MCU (DD2.48)
DUST_SNS_LED_CTRL: MAIN (R16.1), MCU (DD2.58)
DUST_SNS_V: MAIN (C4.2 XP7.5), MCU (R27.1)
JTAG_TCK: MAIN (XP3.1), MCU (DD2.45)
JTAG_TDI: MAIN (XP3.9), MCU (DD2.46)
JTAG_TDO: MAIN (XP3.3), MCU (DD2.42)
JTAG_TMS: MAIN (XP3.5), MCU (DD2.44)
JTAG_TRSTn: MAIN (XP3.8), MCU (DD2.43)
nRST_MCU: MAIN (XP3.6), MCU (C22.2 DD2.14 R34.2)
TEMP_I2C_SCLK: MAIN (R18.1 VD4.2 XP5.3 XP6.3), MCU (DD2.64)
TEMP_I2C_SDA: MAIN (R19.1 VD4.1 XP5.4 XP6.4), MCU (DD2.1)
UART_RX_MCU: MAIN (R3.2 R8.1 VD2.2), MCU (DD2.7)
UART_TX_MCU: MAIN (VD2.1 XP2.2), MCU (DD2.4)

## Assembly variants
I2C_3V3: not fitted R10 R12 R26 R28 R32 R36 VT2 VT4
I2C_5V: not fitted R7 R11 R26 R28 R32 R36